# EasyEDA Pro project Charger Splitter.eprj, board PCB2
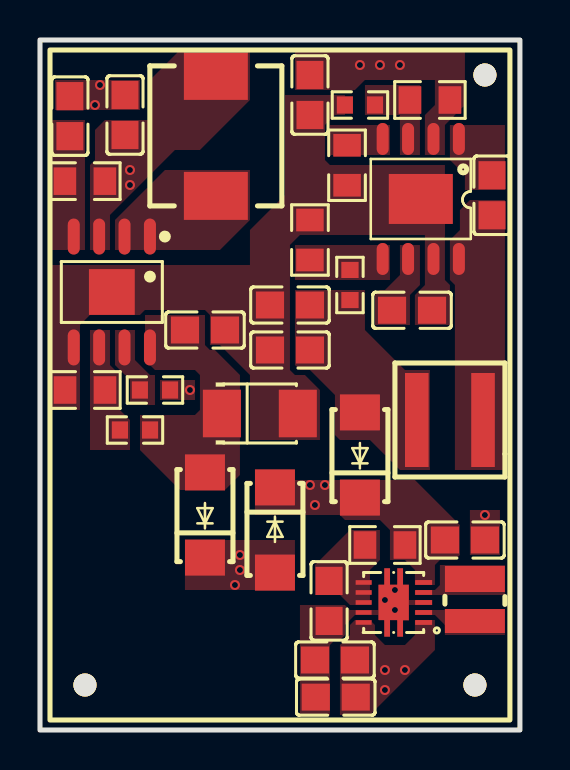
[diagram p7: board, top side]
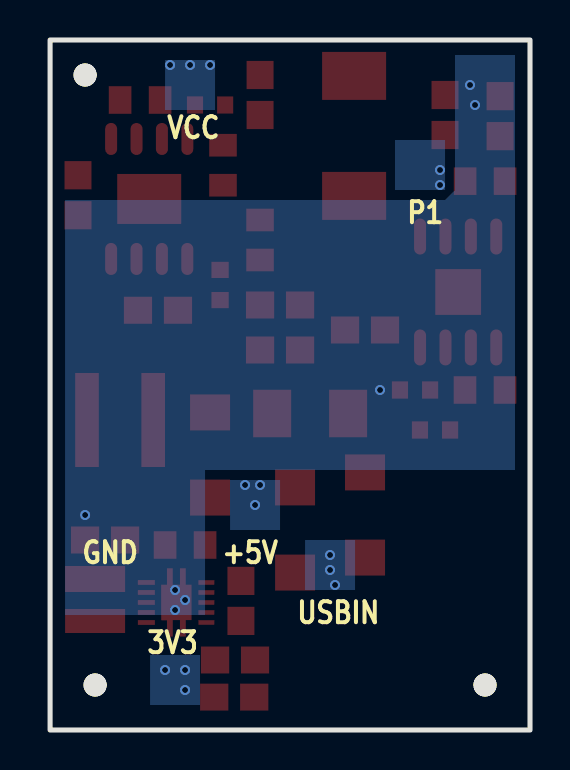
[diagram p8: board, bottom side, seen from below]

Outline 24 x 34.5 mm; copper layers: Top Layer, Bottom Layer. Coordinates in mm from the lower left corner of the outline.
Outline path: rectangle 0,34.5 24,0
Stack: Top Layer 0.035mm / Dielectric1 1.51mm FR4 er 4.5 / Bottom Layer 0.035mm

## Design rules (mm)
template: JLCPCB Capability(Two Layers Board)
spacing copperThickness1oz (default): track to track 0.102, other pairs 0.152 to 0.3
spacing copperThickness2oz: track to track 0.203, other pairs 0.152 to 0.3
track width copperThickness1oz (default): min 0.127, default 0.254, max 2.54
track width copperThickness2oz: min 0.203, default 0.254, max 2.54
differential pair differentialPair (default): width min 0.127, default 0.254, max 2.54; gap min 0.152, default 0.152
via viaSize (default): diameter min 0.5, default 0.61, max 10; hole min 0.3, default 0.305, max 6.3

## Placement (name value [footprint] x y rotation side)
3V3BUCKBOOST1  TPS63001DRCR  [VSON-10_L3.0-W3.0-P0.50-TL-EP_TPS62410DRCR]  17.69 6.38 180 top
3V3C1  10uF  [C0805]  21.25 9.5 180 top
3V3C2  100nF  [C0805]  14.46 6.45 90 top
3V3C3  10uF  [C0805]  14.75 3.5 0 top
3V3C4  10uF  [C0805]  14.79 1.64 0 top
3V3L1  2.2uH  [IND-SMD_L3.0-W3.0_NR3010]  21.75 6.5 270 top
3V3R1  100Ω  [R0805]  17.25 9.25 0 top
5VBC1  22uF  [C0805]  4.25 30.75 270 top
5VBC2  1nF  [C0805]  1.5 30.69 270 top
5VBC4  100uF  [CAP-SMD_L3.5-W2.8-R-RD]  11 15.83 180 top
5VBC5  22uF  [C0805]  8.25 20 180 top
5VBD1  RSX501L-20TE25  [SMA_L4.5-W2.6-LS5.0-RD]  8.25 10.75 90 top
5VBL1  3.3uH  [IND-SMD_L7.0-W6.6]  8.79 29.7 270 top
5VBOOST1  FP6276BXR-G1  [SOP-8_L4.9-W3.9-P1.27-LS6.0-BL-EP]  3.59 21.9 180 top
5VBR1  10kΩ  [R0805]  2.25 27.44 0 top
5VBR2  75kΩ  [R0603]  4.75 15 0 top
5VBR3  10kΩ  [R0805]  2.25 17 180 top
5VBR4  39kΩ  [R0603]  5.75 17 180 top
5VBUCK1  AP64352SP-13  [SO-8_L4.9-W3.9-P1.27-LS6.0-BL-EP]  19.04 26.55 180 top
5VC1  100nF  [C0805]  22.6 26.74 90 top
5VC2  10nF  [C0805]  18.6 20.99 0 top
5VC3  22uF  [C0805]  12.5 19 180 top
5VC4  22uF  [C0805]  12.5 21.25 180 top
5VCx  10uF  [C0805]  13.5 31.75 270 top
5VD1  RSX501L-20TE25  [SMA_L4.5-W2.6-LS5.0-RD]  16 13.75 90 top
5VL1  5.6uH  [IND-SMD_L5.5-W5.3]  20.5 15.5 180 top
5VR1  150kΩ  [R0805]  19.5 31.5 0 top
5VR2  39kΩ  [R0603]  16 31.25 0 top
5VR3  200kΩ  [R0805]  15.35 28.24 90 top
5VR4  120kΩ  [R0603]  15.5 22.25 90 top
5VR5  20kΩ  [R0805]  13.5 24.5 270 top
NOREF  -  [Pad_e82]  21.75 2.25 0 top
NOREF#2  -  [Pad_e83]  2.25 2.25 0 top
NOREF#3  -  [Pad_e81]  22.25 32.75 0 top
USB-IND1  RSX501L-20TE25  [SMA_L4.5-W2.6-LS5.0-RD]  11.75 10 270 top

## Footprints (pads in the part's own frame, mm; a bottom-side part is the same pattern mirrored in y, then rotated)
C0805
  rect 1.41x1.35 smd: 1(-1,0) 2(1,0)
CAP-SMD_L3.5-W2.8-R-RD
  rect 1.9x2.376 smd: 1(1.899,0) 2(-1.899,0)
IND-SMD_L3.0-W3.0_NR3010
  rect 1.3x3 smd: 1(-1.05,0)
  rect 1.2x3 smd: 2(1.05,0)
IND-SMD_L5.5-W5.3
  rect 1.18x4.7 smd: 1(-1.655,0) 2(1.655,0)
IND-SMD_L7.0-W6.6
  rect 2.4x3.2 smd: 1(-3,0) 2(3,0)
Pad_e81
  round 1.152 hole 1.152: 1(0,0)
Pad_e82
  round 1.152 hole 1.152: 1(0,0)
Pad_e83
  round 1.152 hole 1.152: 1(0,0)
R0603
  rect 0.806x0.864 smd: 1(-0.753,0) 2(0.753,0)
R0805
  rect 1.133x1.377 smd: 1(-1,0) 2(1,0)
SMA_L4.5-W2.6-LS5.0-RD
  rect 1.8x2 smd: 1(-2.13,0) 2(2.13,0)
SO-8_L4.9-W3.9-P1.27-LS6.0-BL-EP
  oval 0.6x1.6 smd: 1(-1.905,-3) 2(-0.635,-3) 3(0.635,-3) 4(1.905,-3) 5(1.905,3) 6(0.635,3) 7(-0.635,3) 8(-1.905,3)
  rect 3.2x2.5 smd: 9(0,0)
SOP-8_L4.9-W3.9-P1.27-LS6.0-BL-EP
  oval 0.6x1.8 smd: 1(-1.905,-2.772) 2(-0.635,-2.772) 3(0.635,-2.772) 4(1.905,-2.772) 5(1.905,2.772) 6(0.635,2.772) 7(-0.635,2.772) 8(-1.905,2.772)
  rect 2.29x2.29 smd: 9(0,0)
VSON-10_L3.0-W3.0-P0.50-TL-EP_TPS62410DRCR
  rect 0.85x0.24 smd: 1(-1.5,1) 2(-1.5,0.5) 3(-1.5,0) 4(-1.5,-0.5) 5(-1.5,-1)
  rect 0.8x0.23 smd: 6(1.5,-1) 7(1.5,-0.5) 8(1.5,0) 9(1.5,0.5) 10(1.5,1)
  custom 1.52x3.42 smd: 11(0,-0.005)

## Nets
As in the schematic.

Pads without a net: NOREF 1; NOREF#2 1; NOREF#3 1

## Via types
v1: diameter 0.5, hole 0.3, Top Layer to Bottom Layer, 21 vias

## Routing (per net, layer and track width the routed paths; a pad name or vN(x,y) marks a point on that pad's centre or on a via; arc(x,y) is an arc through that point)
3V3:
  vias: v1(17.25,3) v1(17.25,2) v1(18.25,3)
+5V:
  vias: v1(13.5,12.25) v1(13.75,11.25) v1(14.25,12.25)
GND:
  vias: v1(2.75,31.25) v1(3,32.25) v1(7.5,17) v1(17.25,6.5) v1(17.75,7) v1(17.75,6) v1(22.25,10.75)
VCC:
  vias: v1(16,33.25) v1(17,33.25) v1(18,33.25)
P1:
  vias: v1(4.5,28) v1(4.5,27.25)
USBIN:
  vias: v1(9.75,7.25) v1(10,8.75) v1(10,8)

## Copper pours and planes (outline as drawn; the poured copper is in the pictures)
3V3 on Top Layer: 15,5.5 19.75,5.5 19.75,0.75 15,0.75
3V3 on Bottom Layer: 16.5,3.75 19,3.75 19,1.25 16.5,1.25
+5V on Top Layer: 10.75,12.5 21,12.5 21,7.25 10.75,7.25
+5V on Bottom Layer: 12.5,12.5 15,12.5 15,10 12.5,10
GND on Top Layer: 4.5,23.25 10.75,23.25 10.75,17.75 4.5,17.75
GND on Top Layer: 18.75,25.5 20.5,25.5 20.5,20.25 18.75,20.25
GND on Top Layer: 0.5,23.25 4.75,23.25 4.75,16 0.5,16
GND on Top Layer: 13,6.25 17,6.25 17,0.75 13,0.75
GND on Top Layer: 6,17.5 7.75,17.5 7.75,16.5 6,16.5
GND on Top Layer: 10.5,31.75 20.25,31.75 20.25,14.5 10.5,14.5
GND on Top Layer: 0.75,32.5 5,32.5 5,31 0.75,31
GND on Top Layer: 21.5,11 23,11 23,8.75 21.5,8.75
GND on Bottom Layer: 0.75,33.75 23.25,33.75 23.25,5.75 0.75,5.75
VCC on Top Layer: 12.75,34 21.25,34 21.25,32 12.75,32
VCC on Top Layer: 19.25,32.25 21.25,32.25 21.25,28.75 19.25,28.75
VCC on Bottom Layer: 15.75,33.5 18.25,33.5 18.25,31 15.75,31
P1 on Top Layer: 2.5,34 10.5,34 10.5,24 2.5,24
P1 on Bottom Layer: 4.25,29.5 6.75,29.5 6.75,27 4.25,27
USBIN on Top Layer: 7.25,9.5 12.75,9.5 12.75,7 7.25,7
USBIN on Bottom Layer: 8.75,9.5 11.25,9.5 11.25,7 8.75,7
$1N2362 on Top Layer: 13.75,10 17,10 17,6.25 13.75,6.25
$1N2363 on Top Layer: 18.75,8.25 23.25,8.25 23.25,6.75 18.75,6.75
$1N2366 on Top Layer: 18.75,6 23.25,6 23.25,4.75 18.75,4.75
$1N2893 on Top Layer: 12.75,22 19.5,22 19.5,13 12.75,13
$1N2896 on Top Layer: 16.75,24.25 19,24.25 19,20.25 16.75,20.25
$1N2899 on Top Layer: 12.75,24.25 17.5,24.25 17.5,22.5 12.75,22.5
$1N2901 on Top Layer: 16.25,32.25 19,32.25 19,28.75 16.25,28.75
$1N2902 on Top Layer: 14.5,30.25 17.5,30.25 17.5,28.75 14.5,28.75
$1N2903 on Top Layer: 20.5,30.25 23.25,30.25 23.25,27 20.5,27
$1N2904 on Top Layer: 20.5,26.5 23.25,26.5 23.25,13 20.5,13
$1N3426 on Top Layer: 5,20.75 10,20.75 10,12 5,12
$1N3427 on Top Layer: 2.5,20 4.5,20 4.5,14 2.5,14
$1N3428 on Top Layer: 3.75,28 10.5,28 10.5,24 3.75,24
$1N3429 on Top Layer: 0.5,30.5 2.25,30.5 2.25,24 0.5,24
$1N3432 on Top Layer: 3.75,20 5.75,20 5.75,16.25 3.75,16.25

Small or netless copper shapes (teardrops, artwork), in the pictures only: 1 on Top Layer

## Text on the board
Bottom Silkscreen Layer: P1 | USBIN | +5V | VCC | 3V3 | GND
